# Altium schematic sheet radioModeSW (1).SchDoc
size A; SheetNumber: 1; SheetTotal: 1; SPICEModelCacheCQOJFYCT: <root> / <DocumentId>CQOJFYCT</DocumentId> / <CacheFrame Number="0"> / <Model Name="nmos" Kind="MDL"> / <Text>*Default N-Channel MOSFET / *Pinout: D,G,S / .MODEL NMOS NMOS()</Text> / </Model> / <Model Name="pmos" Kind="MDL"> / <Text>*Default P-Channel MOSFET / *Pinout: D,G,S / .MODEL PMOS PMOS()</Text> / </Model> / </CacheFrame> / </root>
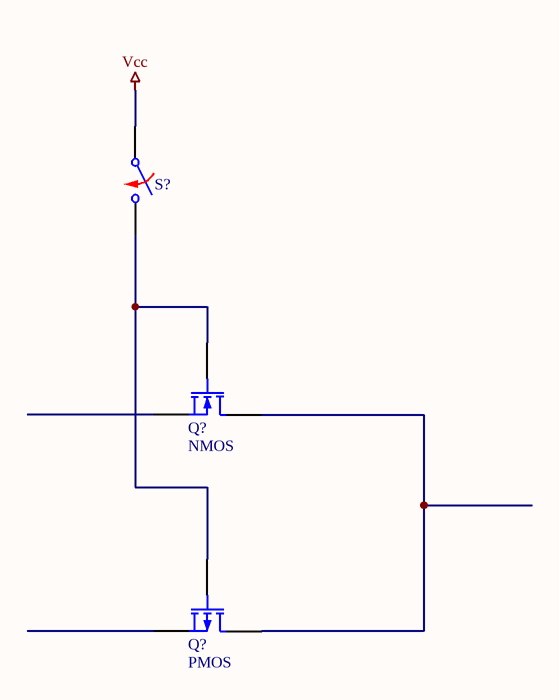
[diagram p0: radioModeSW (1).SchDoc]

## Parts
(Parts that share a designator on the sheet are numbered #1, #2 ... from top to bottom, then left to right.)
Q?#1  NMOS  [E3]
Q?#2  PMOS  [E3]
S?  Switch Normally Opened  (value not drawn)

## Nets
Vcc: S?.1
NetQ?#1_1: Q?#1.1(D) Q?#2.1(D)
NetQ?#1_2: Q?#1.2(G) Q?#2.2(G) S?.2

Not connected (* = marked no-connect by the designer): Q?#1 3(S); Q?#2 3(S)

## Library data of the parts
Q?#1 = MOSFET-N: N-Channel MOSFET; Published: 8-Jun-2000; LatestRevisionDate: 17-Jul-2002; LatestRevisionNote: Re-released for DXP Platform.; PackageVersion: 1995/1996; PackageReference: E3; Publisher: Altium Limited; PackageDescription: TO, Flat Index; 3 In-Line, Axial Leads; Body Dia. 4.6mm; Lead Dia. 0.5 mm (max)
Q?#2 = MOSFET-P: P-Channel MOSFET; Published: 8-Jun-2000; LatestRevisionDate: 17-Jul-2002; LatestRevisionNote: Re-released for DXP Platform.; PackageVersion: 1995/1996; PackageReference: E3; Publisher: Altium Limited; PackageDescription: TO, Flat Index; 3 In-Line, Axial Leads; Body Dia. 4.6mm; Lead Dia. 0.5 mm (max)
S? = SW NO: closed: 0; Rclosed: 1m; Ropen: 1Meg; SimulationGenericComponent: True